# EAGLE design HshMain_v1.1 (EAGLE 7.4.0)
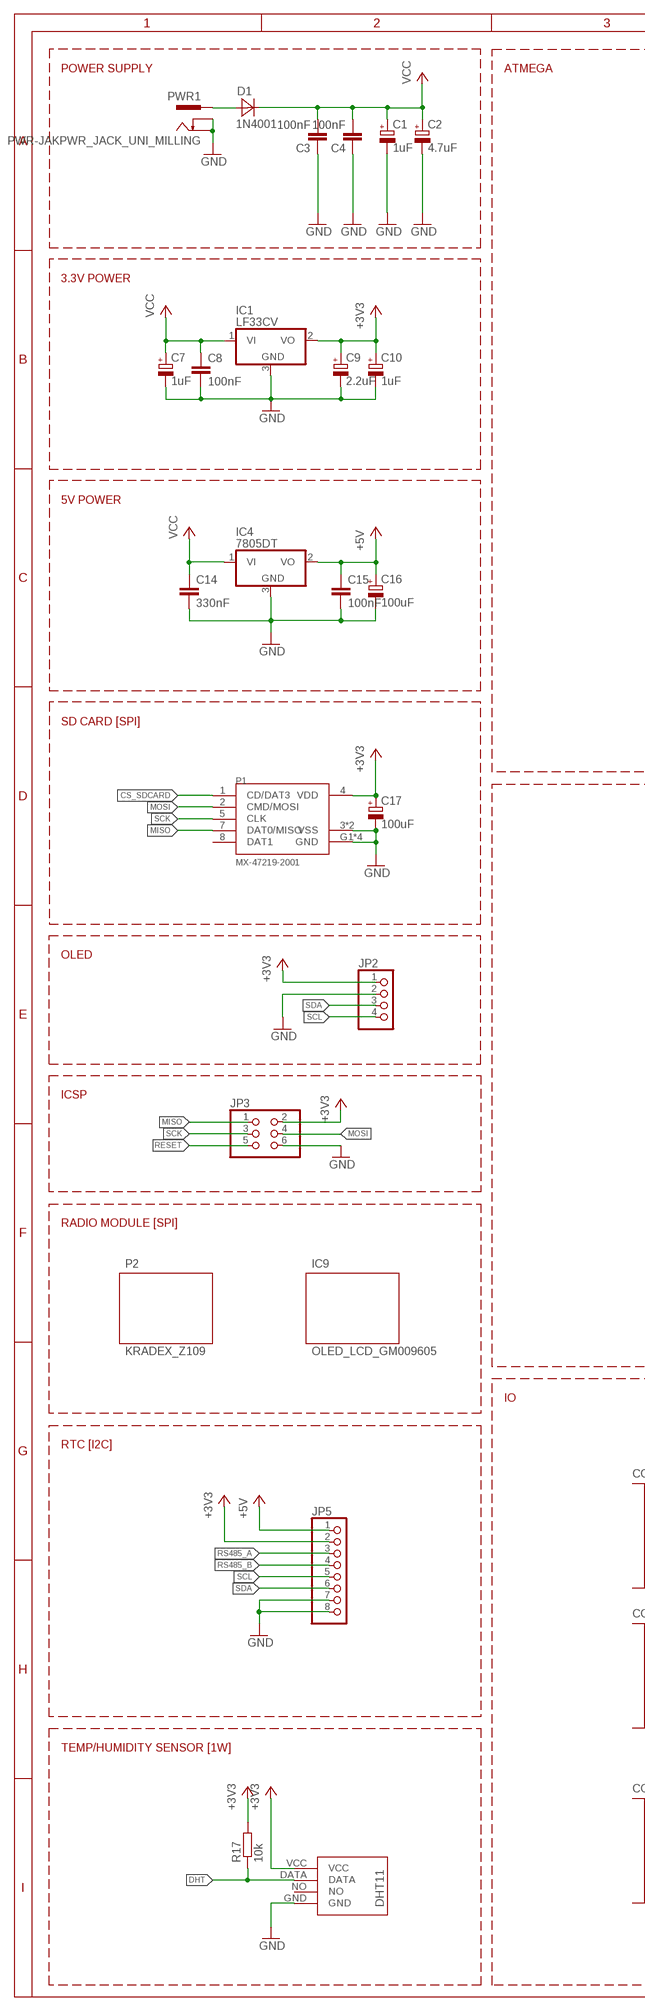
[diagram p0: schematic, sheet 1, part 1 of 2]
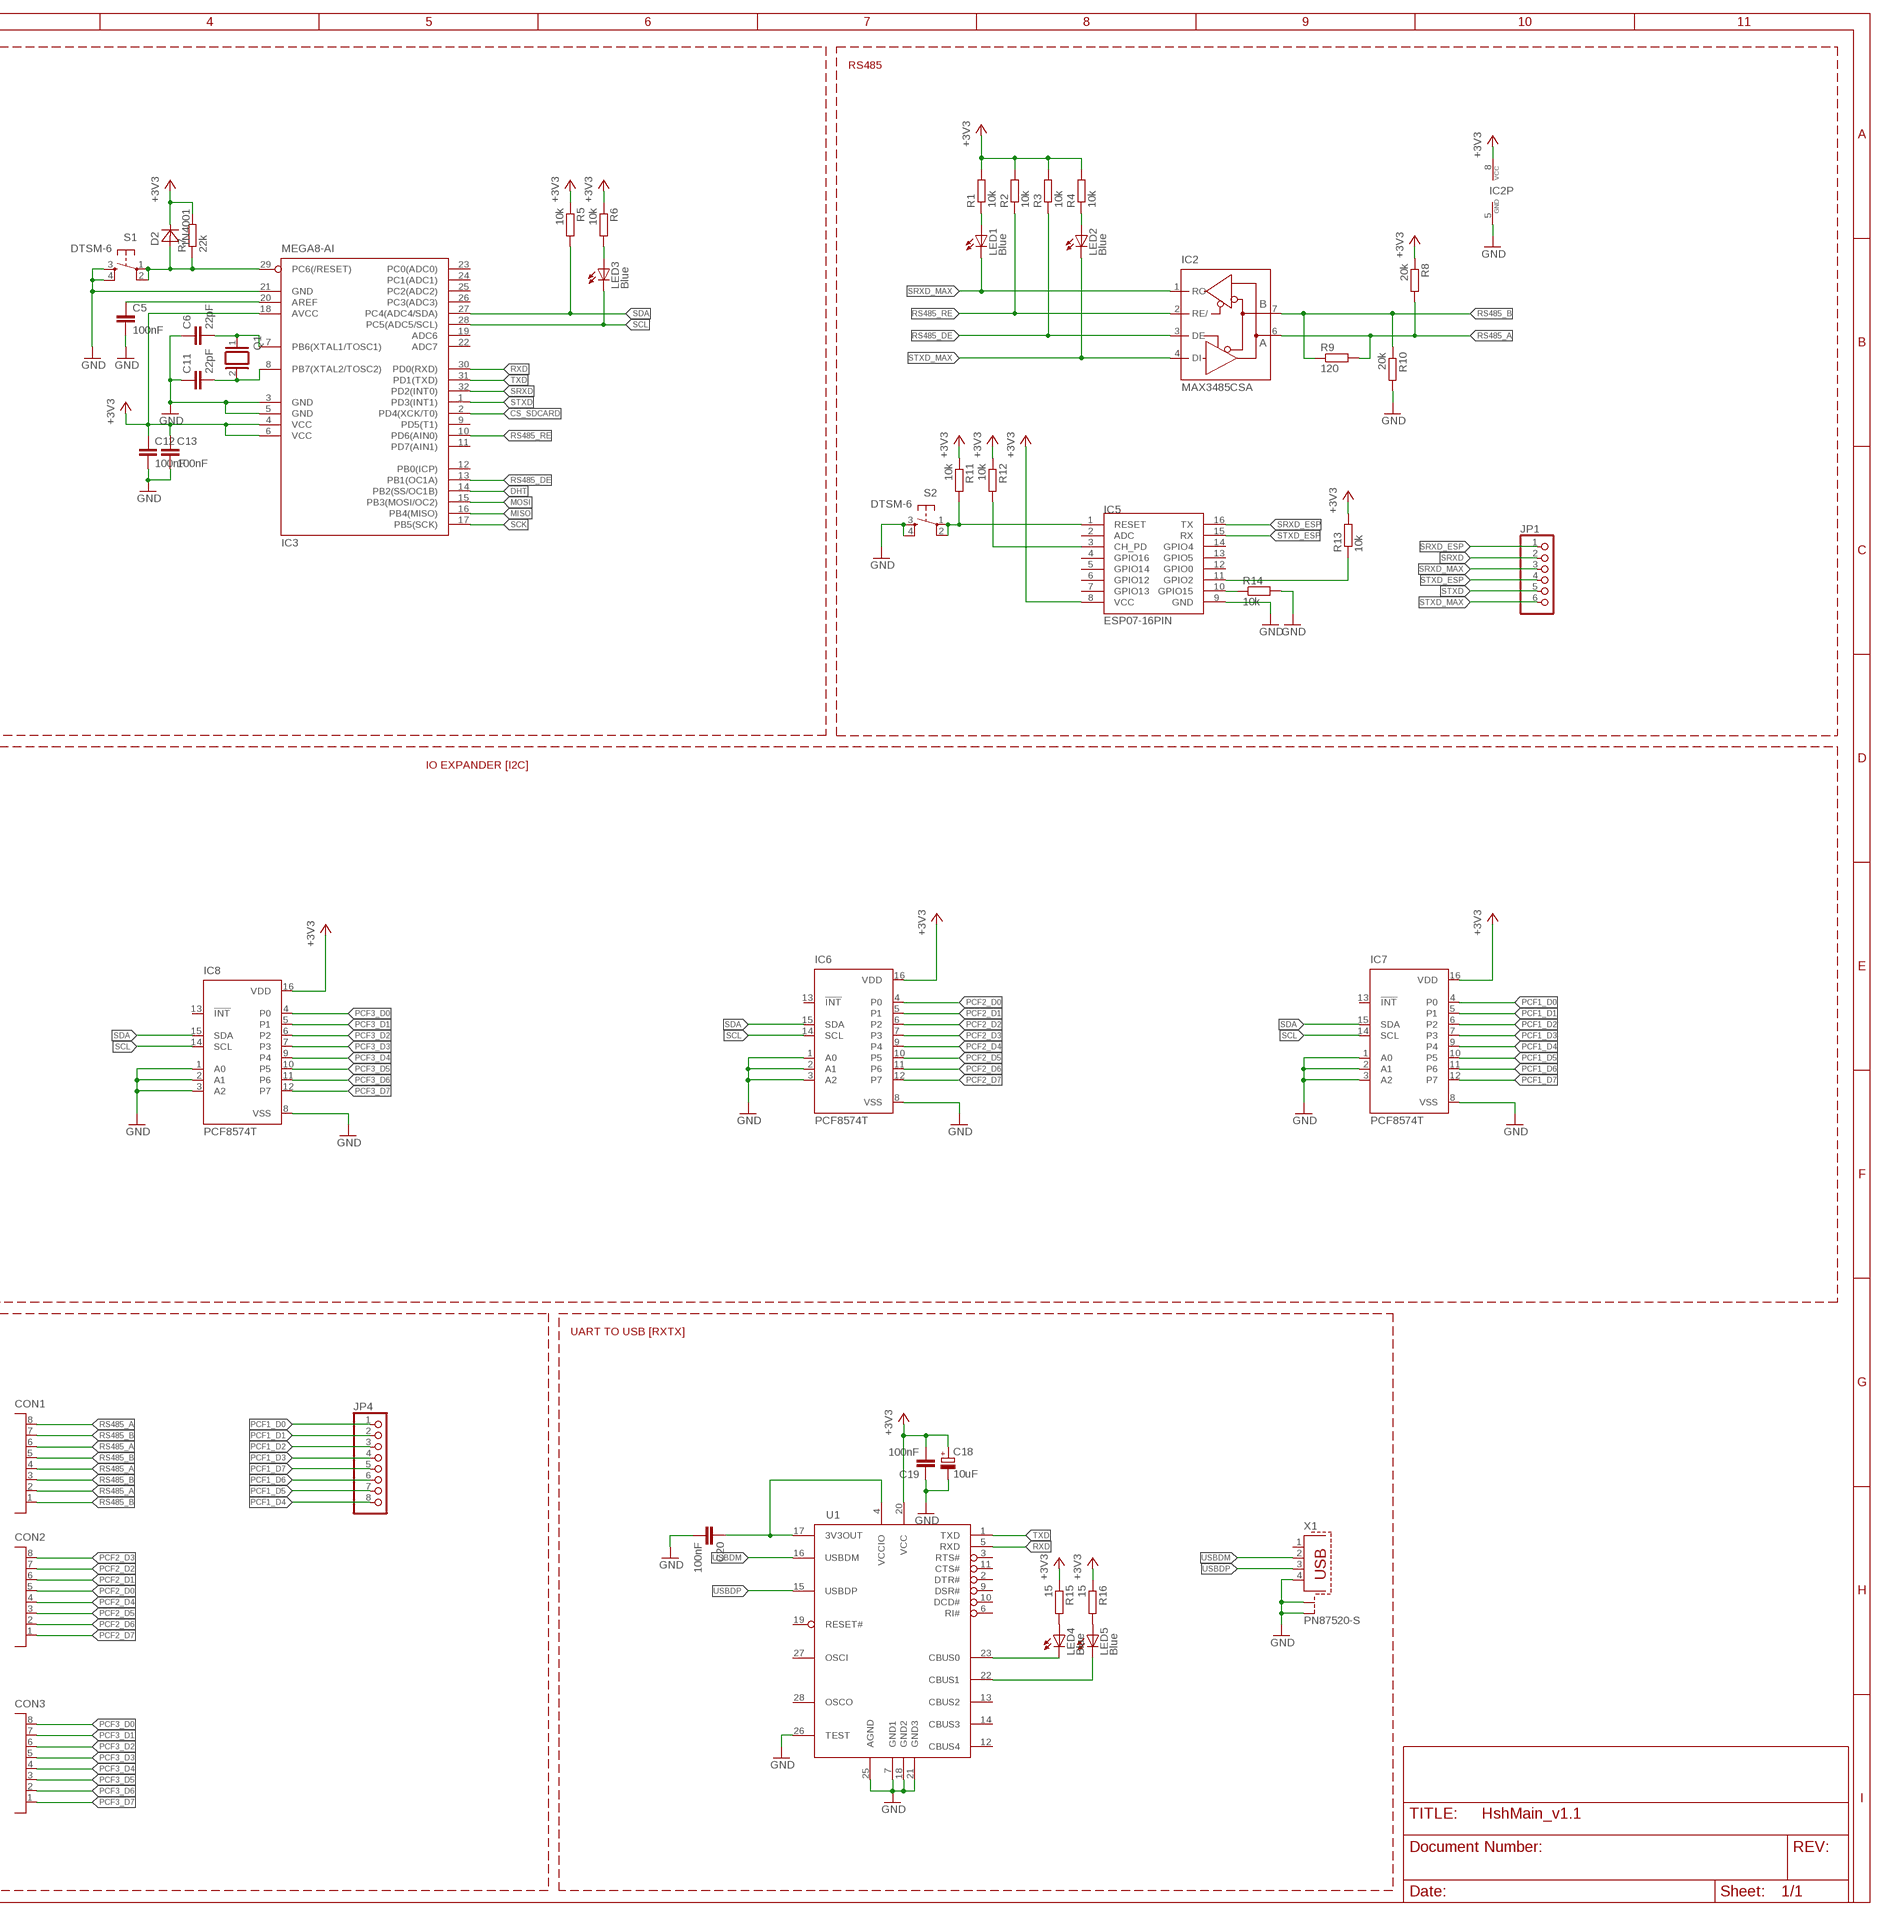
[diagram p1: schematic, sheet 1, part 2 of 2]

## Parts
C1  1uF  CPOL-EUB  [PANASONIC_B]
C2  4.7uF  CPOL-EUB  [PANASONIC_B]
C3  100nF  C-EUC0805  [C0805]
C4  100nF  C-EUC0805  [C0805]
C5  100nF  C-EUC0805  [C0805]
C6  22pF  C-EUC0805  [C0805]
C7  1uF  CPOL-EUB  [PANASONIC_B]
C8  100nF  C-EUC0805  [C0805]
C9  2.2uF  CPOL-EUB  [PANASONIC_B]
C10  1uF  CPOL-EUB  [PANASONIC_B]
C11  22pF  C-EUC0805  [C0805]
C12  100nF  C-EUC0805  [C0805]
C13  100nF  C-EUC0805  [C0805]
C14  330nF  C-EUC0805  [C0805]
C15  100nF  C-EUC0805  [C0805]
C16  100uF  CPOL-EUD  [PANASONIC_D]
C17  100uF  CPOL-EUD  [PANASONIC_D]
C18  10uF  CPOL-EUB  [PANASONIC_B]
C19  100nF  C-EUC0805  [C0805]
C20  100nF  C-EUC0805  [C0805]
CON1  15EDGRC-3.81-8P  [15EDGRC-3.81-8P]
CON2  15EDGRC-3.81-8P  [15EDGRC-3.81-8P]
CON3  15EDGRC-3.81-8P  [15EDGRC-3.81-8P]
D1  1N4001  MBRA340T3  [SMA]
D2  1N4001  MBRA340T3  [SMA]
IC1  LF33CV  78DT  [TO252]
IC2  MAX3485CSA  MAX481CSA  [SO08]
IC3  MEGA8-AI  [TQFP32-08]
IC4  7805DT  [TO252]
IC5  ESP07-16PIN  [ESP07-16PIN]
IC6  PCF8574T  [SO16W]
IC7  PCF8574T  [SO16W]
IC8  PCF8574T  [SO16W]
IC9  OLED_LCD_GM009605  [OLED_LCD_GM009605]
IC10  DHT11-PION.  [DHT11-PION.]
JP1  PINHD-1X6  [1X06]
JP2  PINHD-1X4  [1X04]
JP3  PINHD-2X3  [2X03]
JP4  PINHD-1X8  [1X08]
JP5  PINHD-1X8/90  [1X08/90]
LED1  Blue  LEDSML0805  [SML0805]
LED2  Blue  LEDSML0805  [SML0805]
LED3  Blue  LEDSML0805  [SML0805]
LED4  Blue  LEDSML0805  [SML0805]
LED5  Blue  LEDSML0805  [SML0805]
P1  MX-47219-2001  [MX-47219-2001]
P2  KRADEX_Z109  [KRADEX_Z109]
PWR1  PWR-JAKPWR_JACK_UNI_MILLING  [PWR_JACK_UNI_MILLING]
Q1  XTAL/S  [QS]
R1  10k  R-EU_R0805  [R0805]
R2  10k  R-EU_R0805  [R0805]
R3  10k  R-EU_R0805  [R0805]
R4  10k  R-EU_R0805  [R0805]
R5  10k  R-EU_R0805  [R0805]
R6  10k  R-EU_R0805  [R0805]
R7  22k  R-EU_R0805  [R0805]
R8  20k  R-EU_R0805  [R0805]
R9  120  R-EU_R0805  [R0805]
R10  20k  R-EU_R0805  [R0805]
R11  10k  R-EU_R0805  [R0805]
R12  10k  R-EU_R0805  [R0805]
R13  10k  R-EU_R0805  [R0805]
R14  10k  R-EU_R0805  [R0805]
R15  15  R-EU_R0805  [R0805]
R16  15  R-EU_R0805  [R0805]
R17  10k  R-EU_R0805  [R0805]
S1  DTSM-6  [DTSM-6]
S2  DTSM-6  [DTSM-6]
U1  FT232RL  [SSOP28DB]
X1  PN87520-S  [PN87520-S]

## Nets
+3V3: C9.+ C10.+ C12.1 C13.1 C17.+ C18.+ C19.2 D2.C IC1.2(VO) IC2.8(VCC) IC3.4(VCC) IC3.6(VCC) IC3.18(AVCC) IC5.8(VCC) IC6.16(VDD) IC7.16(VDD) IC8.16(VDD) IC10.VCC JP2.1 JP3.2 JP5.2 P1.4(VDD) R1.2 R2.2 R3.2 R4.2 R5.1 R6.1 R7.2 R8.1 R11.1 R12.1 R13.2 R15.1 R16.1 R17.2 U1.20(VCC)
+5V: C15.1 C16.+ IC4.2(VO) JP5.1
CS_SDCARD: IC3.2(PD4(XCK/T0)) P1.1(CD/DAT3)
DHT: IC3.14(PB2(SS/OC1B)) IC10.DATA R17.1
GND: C1.- C2.- C3.1 C4.1 C5.2 C6.1 C7.- C8.2 C9.- C10.- C11.1 C12.2 C13.2 C14.2 C15.2 C16.- C17.- C18.- C19.1 C20.2 IC1.3(GND) IC2.5(GND) IC3.3(GND) IC3.5(GND) IC3.21(GND) IC4.3(GND) IC5.9(GND) IC6.1(A0) IC6.2(A1) IC6.3(A2) IC6.8(VSS) IC7.1(A0) IC7.2(A1) IC7.3(A2) IC7.8(VSS) IC8.1(A0) IC8.2(A1) IC8.3(A2) IC8.8(VSS) IC10.GND JP2.2 JP3.6 JP5.7 JP5.8 P1.3(VSS) P1.6(VSS) P1.G1(GND) P1.G2(GND) P1.G3(GND) P1.G4(GND) PWR1.- PWR1.-1(-) PWR1.-2(-) PWR1.-3(-) PWR1.-4(-) PWR1.-5(-) PWR1.-6(-) PWR1.-7(-) PWR1.-8(-) PWR1.-- PWR1.--1(--) PWR1.--2(--) PWR1.--3(--) PWR1.--4(--) PWR1.--5(--) PWR1.--6(--) PWR1.--7(--) PWR1.--8(--) R10.2 R14.2 S1.3 S1.4 S2.3 S2.4 U1.7(GND1) U1.18(GND2) U1.21(GND3) U1.25(AGND) U1.26(TEST) X1.4 X1.S1 X1.S2
MISO: IC3.16(PB4(MISO)) JP3.1 P1.7(DAT0/MISO)
MOSI: IC3.15(PB3(MOSI/OC2)) JP3.4 P1.2(CMD/MOSI)
N$1: C5.1 IC3.20(AREF)
N$2: LED1.A R1.1
N$3: LED2.A R4.1
N$4: D1.A PWR1.+ PWR1.+1(+) PWR1.+2(+) PWR1.+3(+) PWR1.+4(+) PWR1.+5(+) PWR1.+6(+) PWR1.+7(+) PWR1.+8(+)
N$5: LED3.A R6.2
N$7: IC5.10(GPIO15) R14.1
N$8: IC5.11(GPIO2) R13.1
N$9: IC5.1(RESET) R11.2 S2.1 S2.2
N$12: IC5.3(CH_PD) R12.2
N$27: LED4.C U1.23(CBUS0)
N$28: LED5.C U1.22(CBUS1)
N$29: C6.2 IC3.7(PB6(XTAL1/TOSC1)) Q1.1
N$32: LED4.A R15.2
N$33: LED5.A R16.2
N$35: C11.2 IC3.8(PB7(XTAL2/TOSC2)) Q1.2
N$96: C20.1 U1.4(VCCIO) U1.17(3V3OUT)
PCF1_D0: IC7.4(P0) JP4.1
PCF1_D1: IC7.5(P1) JP4.2
PCF1_D2: IC7.6(P2) JP4.3
PCF1_D3: IC7.7(P3) JP4.4
PCF1_D4: IC7.9(P4) JP4.8
PCF1_D5: IC7.10(P5) JP4.7
PCF1_D6: IC7.11(P6) JP4.6
PCF1_D7: IC7.12(P7) JP4.5
PCF2_D0: CON2.5 IC6.4(P0)
PCF2_D1: CON2.6 IC6.5(P1)
PCF2_D2: CON2.7 IC6.6(P2)
PCF2_D3: CON2.8 IC6.7(P3)
PCF2_D4: CON2.4 IC6.9(P4)
PCF2_D5: CON2.3 IC6.10(P5)
PCF2_D6: CON2.2 IC6.11(P6)
PCF2_D7: CON2.1 IC6.12(P7)
PCF3_D0: CON3.8 IC8.4(P0)
PCF3_D1: CON3.7 IC8.5(P1)
PCF3_D2: CON3.6 IC8.6(P2)
PCF3_D3: CON3.5 IC8.7(P3)
PCF3_D4: CON3.4 IC8.9(P4)
PCF3_D5: CON3.3 IC8.10(P5)
PCF3_D6: CON3.2 IC8.11(P6)
PCF3_D7: CON3.1 IC8.12(P7)
RESET: D2.A IC3.29(PC6(/RESET)) JP3.5 R7.1 S1.1 S1.2
RS485_A: CON1.2 CON1.4 CON1.6 CON1.8 IC2.6(A) JP5.3 R8.2 R9.2
RS485_B: CON1.1 CON1.3 CON1.5 CON1.7 IC2.7(B) JP5.4 R9.1 R10.1
RS485_DE: IC2.3(DE) IC3.13(PB1(OC1A)) R3.1
RS485_RE: IC2.2(RE/) IC3.10(PD6(AIN0)) R2.1
RXD: IC3.30(PD0(RXD)) U1.5(RXD)
SCK: IC3.17(PB5(SCK)) JP3.3 P1.5(CLK)
SCL: IC3.28(PC5(ADC5/SCL)) IC6.14(SCL) IC7.14(SCL) IC8.14(SCL) JP2.4 JP5.5 LED3.C
SDA: IC3.27(PC4(ADC4/SDA)) IC6.15(SDA) IC7.15(SDA) IC8.15(SDA) JP2.3 JP5.6 R5.2
SRXD: IC3.32(PD2(INT0)) JP1.2
SRXD_ESP: IC5.16(TX) JP1.1
SRXD_MAX: IC2.1(RO) JP1.3 LED1.C
STXD: IC3.1(PD3(INT1)) JP1.5
STXD_ESP: IC5.15(RX) JP1.4
STXD_MAX: IC2.4(DI) JP1.6 LED2.C
TXD: IC3.31(PD1(TXD)) U1.1(TXD)
USBDM: U1.16(USBDM) X1.2
USBDP: U1.15(USBDP) X1.3
VCC: C1.+ C2.+ C3.2 C4.2 C7.+ C8.1 C14.1 D1.C IC1.1(VI) IC4.1(VI)
Unconnected: IC3.9(PD5(T1)) IC3.11(PD7(AIN1)) IC3.12(PB0(ICP)) IC3.19(ADC6) IC3.22(ADC7) IC3.23(PC0(ADC0)) IC3.24(PC1(ADC1)) IC3.25(PC2(ADC2)) IC3.26(PC3(ADC3)) IC5.2(ADC) IC5.4(GPIO16) IC5.5(GPIO14) IC5.6(GPIO12) IC5.7(GPIO13) IC5.12(GPIO0) IC5.13(GPIO5) IC5.14(GPIO4) IC6.13(!INT) IC7.13(!INT) IC8.13(!INT) IC10.NO P1.8(DAT1) U1.2(DTR#) U1.3(RTS#) U1.6(RI#) U1.9(DSR#) U1.10(DCD#) U1.11(CTS#) U1.12(CBUS4) U1.13(CBUS2) U1.14(CBUS3) U1.19(RESET#) U1.27(OSCI) U1.28(OSCO) X1.1

## Notes on the sheet
- POWER SUPPLY | ATMEGA | RS485
- 3.3V POWER
- 5V POWER
- SD CARD [SPI]
- IO EXPANDER [I2C]
- OLED
- ICSP
- RADIO MODULE [SPI]
- IO | UART TO USB [RXTX]
- RTC [I2C]
- TEMP/HUMIDITY SENSOR [1W]

## Library data of the parts
C1 C2 C7 C9 C10 C16-C18 = rcl:CPOL-EU: POLARIZED CAPACITOR, European symbol
C3-C6 C8 C11-C15 C19 C20 = rcl:C-EU: CAPACITOR, European symbol
CON1-CON3 = con-degson:15EDGRC-3.81-8P
D1 D2 = diode:MBRA340T3: Surface Mount Schottky Power Rectifier Source: http://www.onsemi.com/pub_link/Collateral/MBRA340T3-D.PDF
IC1 = hosho:78*: Positive VOLTAGE REGULATOR Source: http://cache.national.com/ds/LM/LM78L05.pdf http://www.fairchildsemi.com/ds/LM/LM7805.pdf
IC2 = maxim:MAX481CSA: RS485 TRANSEIVER; MF: MAXIM; MPN: MAX481CSA; OC_FARNELL: unknown; OC_NEWARK: 90C3817
IC3 = atmel:MEGA8: MICROCONTROLLER 8 Kbytes FLASH, 1 kbytes SRAM, 512 bytes EEPROM, USART, 6-channel 10 bit ADC, 2-channel 8 bit ADC Pin compatible with Atmega48, ATMega88, ATMega168 Source: avr.lbr; MPN: ATMEGA8-16AU; OC_FARNELL: 9171371; OC_NEWARK: 73M8863
IC4 = linear:78*: Positive VOLTAGE REGULATOR Source: http://cache.national.com/ds/LM/LM78L05.pdf http://www.fairchildsemi.com/ds/LM/LM7805.pdf
IC5 = esp8266modules:ESP07-16PIN: ESP8266 Wifi module 07 - 16 pins; DIMENSIONS: 22.0 x 16.0 mm; PINS: 16; PITCH: 0.078" / 2 mm
IC6-IC8 = micro-philips:PCF8574: I2C-Bus Remote 8-bit I/O expander http://www.semiconductors.philips.com/acrobat_download/datasheets/PCF8574_4.pdf; MPN: PCF8574T/3,512; OC_FARNELL: 1201255; OC_NEWARK: 70R6870
IC9 = hosho:OLED_LCD_GM009605
IC10 = hosho:DHT11-PION.: DHT11 Czujnik temperatury i wilgotności (widok pionowy)
JP1 = pinhead:PINHD-1X6: PIN HEADER
JP2 = pinhead:PINHD-1X4: PIN HEADER
JP3 = pinhead:PINHD-2X3: PIN HEADER
JP4 JP5 = pinhead:PINHD-1X8: PIN HEADER
LED1-LED5 = led:LED: LED OSRAM: - CHIPLED LG R971, LG N971, LY N971, LG Q971, LY Q971, LO R971, LY R971 LH N974, LH R974 LS Q976, LO Q976, LY Q976 LO Q996 - Hyper CHIPLED LW Q18S LB Q993, LB Q99A, LB R99A - SideLED LS A670, LO A670, LY A670, LG A670, LP A670 LB A673, LV A673, LT A673, LW A673 LH A674 LY A675 LS A676, LA A676, LO A676, LY A676, LW A676 LS A679, LY A679, LG A679 - Hyper Micro SIDELED® LS Y876, LA Y876, LO Y876, LY Y876 LT Y87S - SmartLED LW L88C, LW L88S LB L89C, LB L89S, LG L890 LS L89K, LO L89K, LY L89K LS L896, LA L896, LO L896, LY L896 - TOPLED LS T670, LO T670, LY T670, LG T670, LP T670 LSG T670, LSP T670, LSY T670, LOP T670, LYG T670 LG T671, LOG T671, LSG T671 LB T673, LV T673, LT T673, LW T673 LH T674 LS T676, LA T676, LO T676, LY T676, LB T676, LH T676, LSB T676, LW T676 LB T67C, LV T67C, LT T67C, LS T67K, LO T67K, LY T67K, LW E67C LS E67B, LA E67B, LO E67B, LY E67B, LB E67C, LV E67C, LT E67C LW T67C LS T679, LY T679, LG T679 LS T770, LO T770, LY T770, LG T770, LP T770 LB T773, LV T773, LT T773, LW T773 LH T774 LS E675, LA E675, LY E675, LS T675 LS T776, LA T776, LO T776, LY T776, LB T776 LHGB T686 LT T68C, LB T68C - Hyper Mini TOPLED® LB M676 - Mini TOPLED Santana® LG M470 LS M47K, LO M47K, LY M47K Source: http://www.osram.convergy.de LUXEON: - LUMILED® LXK2-PW12-R00, LXK2-PW12-S00, LXK2-PW14-U00, LXK2-PW14-V00 LXK2-PM12-R00, LXK2-PM12-S00, LXK2-PM14-U00 LXK2-PE12-Q00, LXK2-PE12-R00, LXK2-PE12-S00, LXK2-PE14-T00, LXK2-PE14-U00 LXK2-PB12-K00, LXK2-PB12-L00, LXK2-PB12-M00, LXK2-PB14-N00, LXK2-PB14-P00, LXK2-PB14-Q00 LXK2-PR12-L00, LXK2-PR12-M00, LXK2-PR14-Q00, LXK2-PR14-R00 LXK2-PD12-Q00, LXK2-PD12-R00, LXK2-PD12-S00 LXK2-PH12-R00, LXK2-PH12-S00 LXK2-PL12-P00, LXK2-PL12-Q00, LXK2-PL12-R00 Source: www.luxeon.com KINGBRIGHT: KA-3528ASYC Source: www.kingbright.com
P1 = hosho:MX-47219-2001
P2 = hosho:KRADEX_Z109
PWR1 = hosho:PWR-JAK
Q1 = special:XTAL/S: CRYSTAL
R1-R17 = rcl:R-EU_: RESISTOR, European symbol
S1 S2 = hosho:DTSM-6
U1 = ftdichip-5:FT232RL: USB UART 4th Generation USB UART (USB <-> Serial) Controller
X1 = hosho:PN87520-S; OC_FARNELL: unknown; OC_NEWARK: unknown

## Board
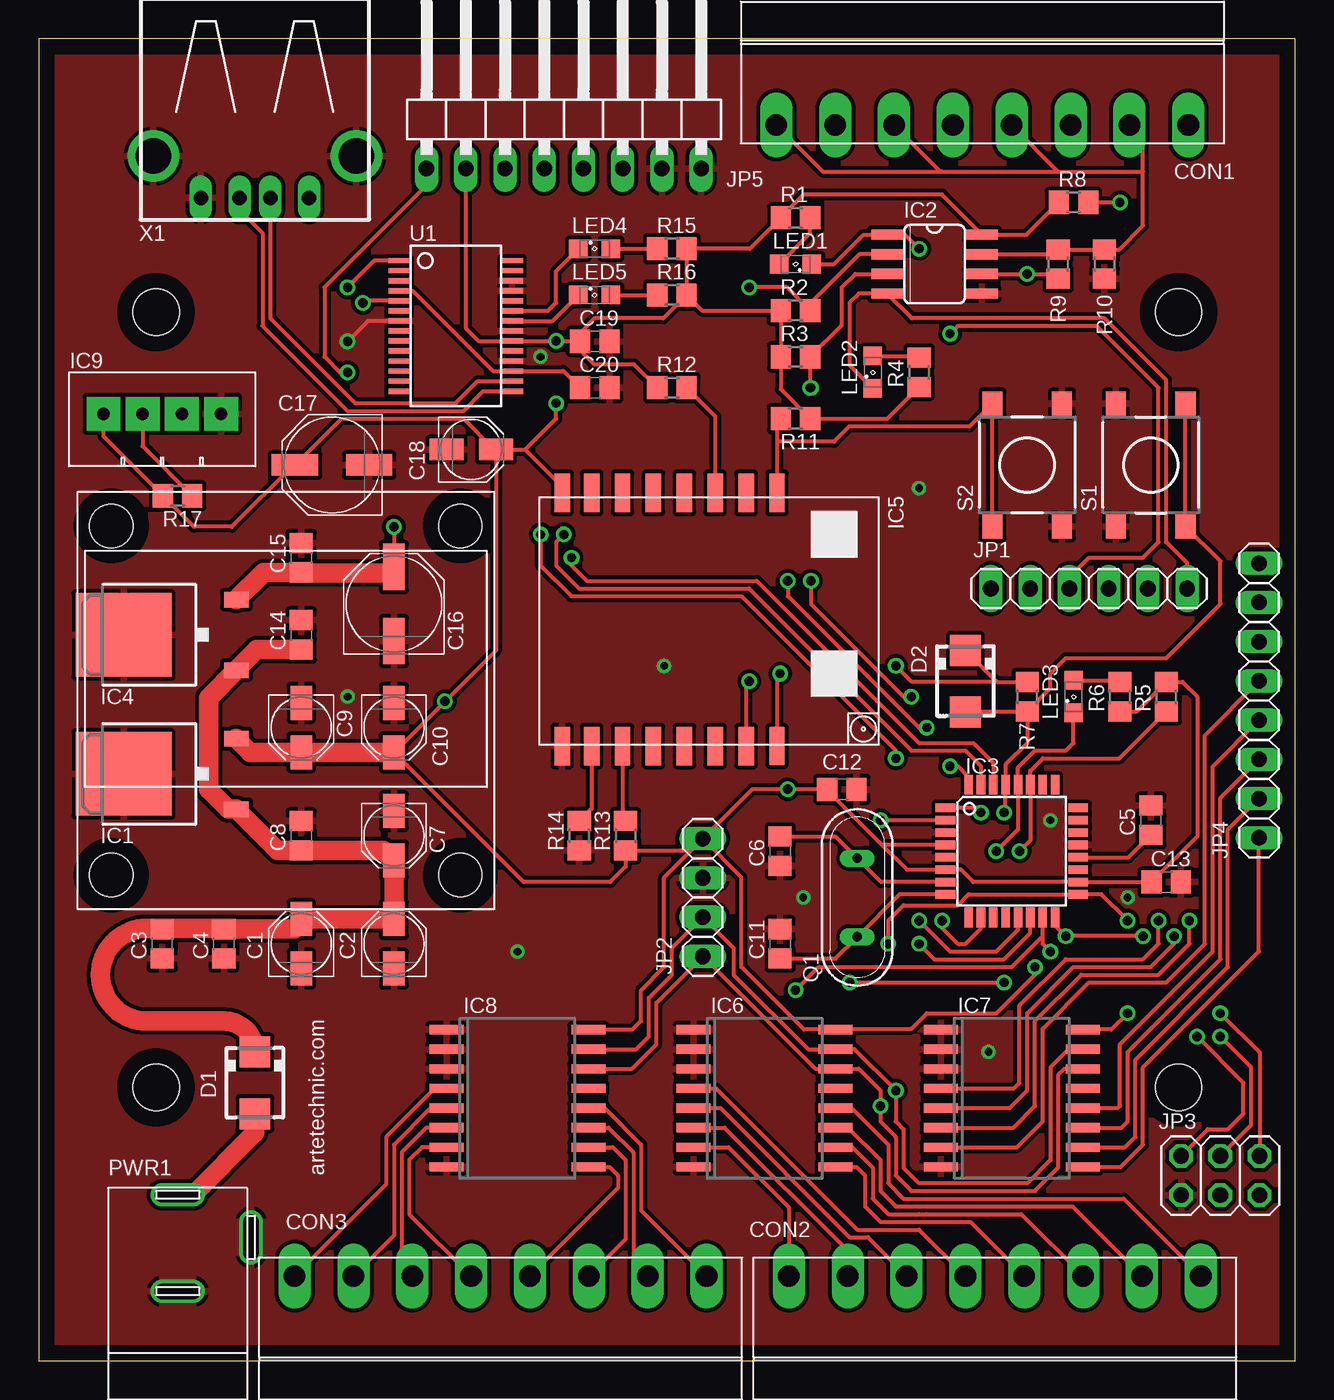
[diagram p2: board, top side]
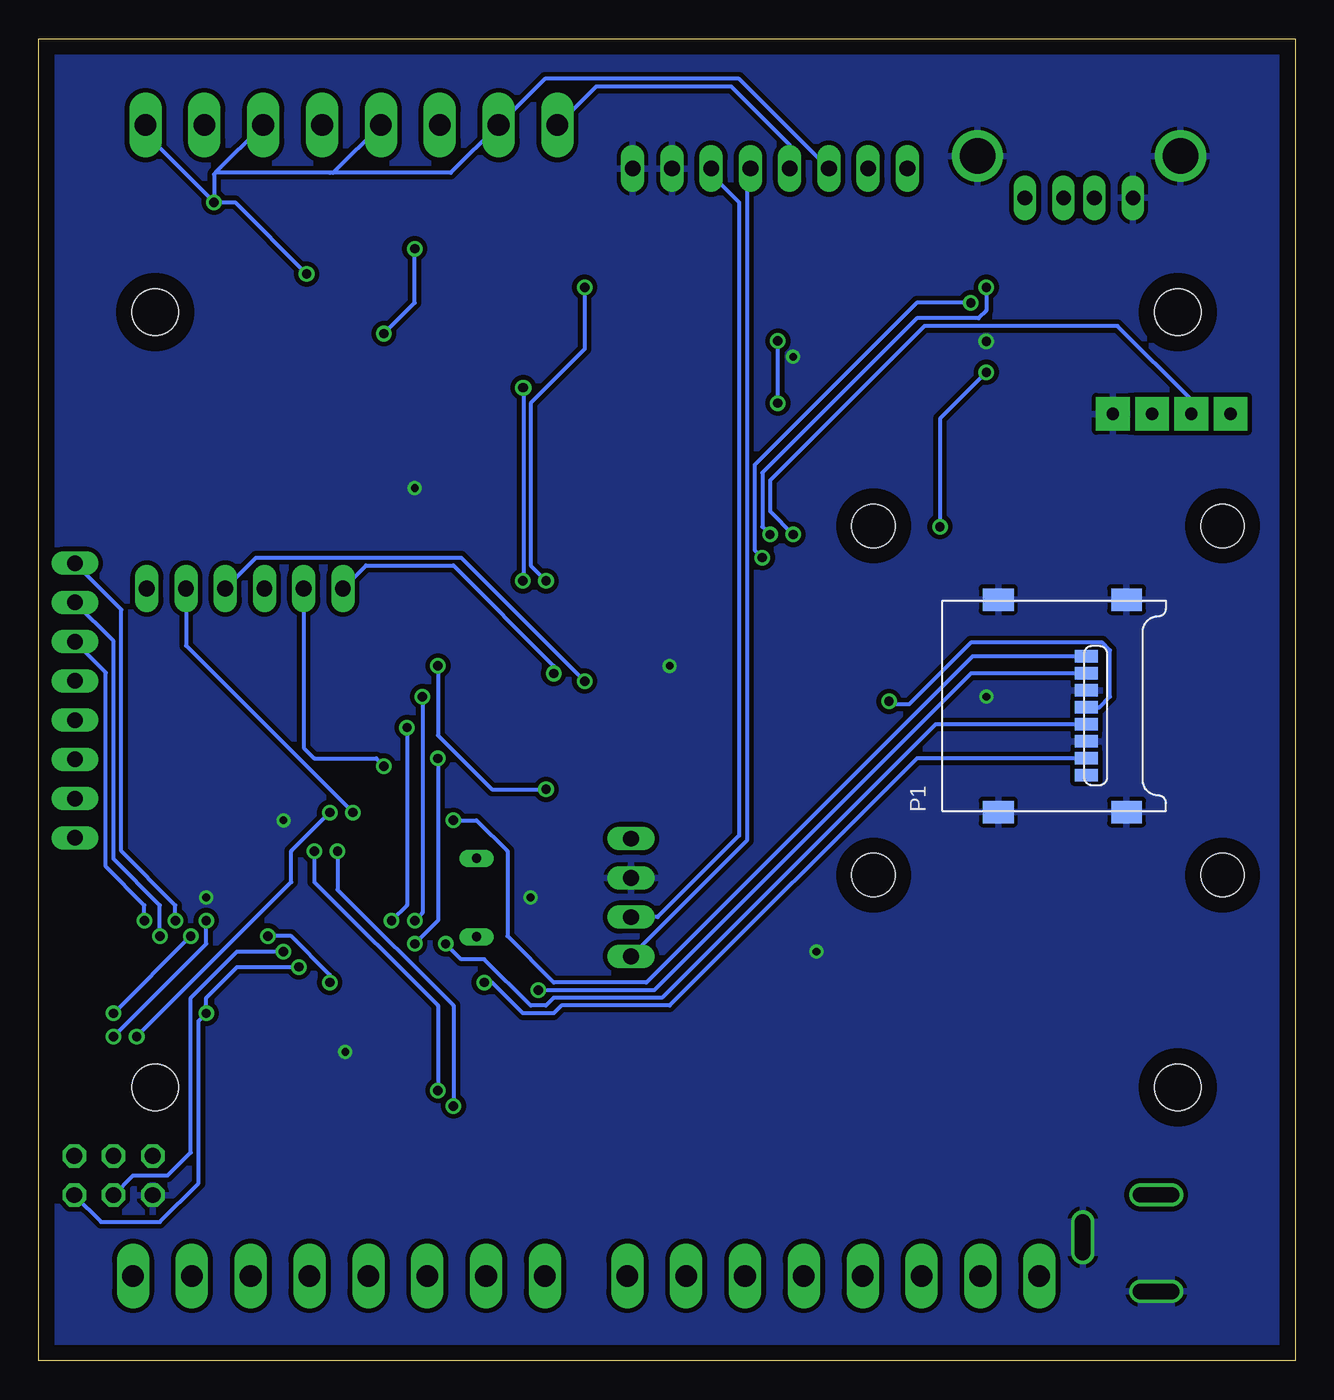
[diagram p3: board, bottom side, seen from below]

Size 81.35 x 85.6 mm. Coordinates in mm from the lower left corner, seen from the top.
Outline: 0,0 81.35,0 81.35,85.6 0,85.6 0,0
Copper layers (1*16): Top 0.035mm / dielectric 1.5mm / Bottom 0.035mm
Design rules "default": minimum track width 10mil, minimum drill 24mil, track to track 8mil, track to pad 8mil, pad to pad 8mil, via to via 8mil, smd to smd 8mil, copper to edge 40mil, drill to drill 8mil, minimum pad ring 10mil, minimum via ring 8mil, stop-mask expansion 4mil, vias tented up to drill 0mil, thermal gap 10mil
Holes 3 mm at 7.6,17.7 73.8,17.7 7.6,67.9 73.8,67.9

### Footprints (pad centres in the part's own frame; a part is rotated, then mirrored left to right if it is on the bottom)
PANASONIC_B = smd 2.2 x 1.4: + 1.6,0; - -1.6,0
C0805 = smd 1.3 x 1.5: 1 -0.95,0; 2 0.95,0
PANASONIC_D = smd 3 x 1.4: + 2.4,0; - -2.4,0
15EDGRC-3.81-8P = drill 1.4 long: 1 -15.24,0; 2 -11.43,0; 3 -7.62,0; 4 -3.81,0; 5 0,0; 6 3.81,0; 7 7.62,0; 8 11.43,0
SMA = smd 2 x 2: A 2,0; C -2,0
TO252 = smd 1 x 1.6: 1 -2.28,-4.8; 2 2.28,-4.8 | smd 5.4 x 6.2: 3 0,2.5
SO08 = smd 0.66 x 2.032: 1 -1.905,-3.073; 2 -0.635,-3.073; 3 0.635,-3.073; 4 1.905,-3.073; 5 1.905,3.073; 6 0.635,3.073; 7 -0.635,3.073; 8 -1.905,3.073
TQFP32-08 = smd 1.27 x 0.559: 1 -4.293,2.8; 2 -4.293,2; 3 -4.293,1.2; 4 -4.293,0.4; 5 -4.293,-0.4; 6 -4.293,-1.2; 7 -4.293,-2; 8 -4.293,-2.8; 17 4.293,-2.8; 18 4.293,-2; 19 4.293,-1.2; 20 4.293,-0.4; 21 4.293,0.4; 22 4.293,1.2; 23 4.293,2; 24 4.293,2.8 | smd 0.559 x 1.27: 9 -2.8,-4.293; 10 -2,-4.293; 11 -1.2,-4.293; 12 -0.4,-4.293; 13 0.4,-4.293; 14 1.2,-4.293; 15 2,-4.293; 16 2.8,-4.293; 25 2.8,4.293; 26 2,4.293; 27 1.2,4.293; 28 0.4,4.293; 29 -0.4,4.293; 30 -1.2,4.293; 31 -2,4.293; 32 -2.8,4.293
ESP07-16PIN = smd 2.5 x 1: 1 -8.2,5.8; 2 -8.2,3.8; 3 -8.2,1.8; 4 -8.2,-0.2; 5 -8.2,-2.2; 6 -8.2,-4.2; 7 -8.2,-6.2; 8 -8.2,-8.105; 9 8.2,-8.105; 10 8.2,-6.2; 11 8.2,-4.2; 12 8.2,-2.2; 13 8.2,-0.2; 14 8.2,1.8; 15 8.2,3.8; 16 8.2,5.8
SO16W = smd 0.6 x 2.2: 1 -4.445,-4.6; 2 -3.175,-4.6; 3 -1.905,-4.6; 4 -0.635,-4.6; 5 0.635,-4.6; 6 1.905,-4.6; 7 3.175,-4.6; 8 4.445,-4.6; 9 4.445,4.6; 10 3.175,4.6; 11 1.905,4.6; 12 0.635,4.6; 13 -0.635,4.6; 14 -1.905,4.6; 15 -3.175,4.6; 16 -4.445,4.6
OLED_LCD_GM009605 = hole 2.8: -11.3,-11.3; -11.3,11.3; 11.3,11.3; 11.3,-11.3
DHT11-PION. = drill 0.8 pad 2.184 square: DATA -1.27,0.305; GND 3.81,0.305; NO 1.27,0.305; VCC -3.81,0.305
1X06 = drill 1.016 long: 1 -6.35,0; 2 -3.81,0; 3 -1.27,0; 4 1.27,0; 5 3.81,0; 6 6.35,0
1X04 = drill 1.016 long: 1 -3.81,0; 2 -1.27,0; 3 1.27,0; 4 3.81,0
2X03 = drill 1.016 octagon: 1 -2.54,-1.27; 2 -2.54,1.27; 3 0,-1.27; 4 0,1.27; 5 2.54,-1.27; 6 2.54,1.27
1X08 = drill 1.016 long: 1 -8.89,0; 2 -6.35,0; 3 -3.81,0; 4 -1.27,0; 5 1.27,0; 6 3.81,0; 7 6.35,0; 8 8.89,0
1X08/90 = drill 1.016 long: 1 -8.89,-3.81; 2 -6.35,-3.81; 3 -3.81,-3.81; 4 -1.27,-3.81; 5 1.27,-3.81; 6 3.81,-3.81; 7 6.35,-3.81; 8 8.89,-3.81
SML0805 = smd 1.2 x 1.2: A 1.05,0; C -1.05,0
MX-47219-2001 = smd 0.8 x 1.5: 1 10.08,2.6; 2 8.98,2.6; 3 7.88,2.6; 4 6.78,2.6; 5 5.68,2.6; 6 4.58,2.6; 7 3.48,2.6; 8 2.38,2.6 | smd 1.45 x 2: G1 13.75,0; G2 13.75,8.3; G3 0,8.3; G4 0,0
PWR_JACK_UNI_MILLING = drill 1: + -6.25,0; +1 -6.25,0.25; +2 -6.25,0.5; +3 -6.25,0.75; +4 -6.25,1; +5 -6.25,-0.25; +6 -6.25,-0.5; +7 -6.25,-0.75; +8 -6.25,-1; - 0,0; -1 0,0.25; -2 0,0.5; -3 0,0.75; -4 0,1; -5 0,-0.25; -6 0,-0.5; -7 0,-0.75; -8 0,-1; -- -3.5,4.75; --1 -3.75,4.75; --2 -4,4.75; --3 -4.25,4.75; --4 -4.5,4.75; --5 -3.25,4.75; --6 -3,4.75; --7 -2.75,4.75; --8 -2.5,4.75
QS = drill 0.61 long: 1 -2.54,0; 2 2.54,0
R0805 = smd 1.3 x 1.5: 1 -0.95,0; 2 0.95,0
DTSM-6 = smd 1.55 x 1.3: 1 -3.975,2.25; 2 3.975,2.25; 3 -3.975,-2.25; 4 3.975,-2.25
SSOP28DB = smd 0.348 x 1.397: 1 -4.225,-3.656; 2 -3.575,-3.656; 3 -2.925,-3.656; 4 -2.275,-3.656; 5 -1.625,-3.656; 6 -0.975,-3.656; 7 -0.325,-3.656; 8 0.325,-3.656; 9 0.975,-3.656; 10 1.625,-3.656; 11 2.275,-3.656; 12 2.925,-3.656; 13 3.575,-3.656; 14 4.225,-3.656; 15 4.225,3.656; 16 3.575,3.656; 17 2.925,3.656; 18 2.275,3.656; 19 1.625,3.656; 20 0.975,3.656; 21 0.325,3.656; 22 -0.325,3.656; 23 -0.975,3.656; 24 -1.625,3.656; 25 -2.275,3.656; 26 -2.925,3.656; 27 -3.575,3.656; 28 -4.225,3.656
PN87520-S = drill 0.95 long: 1 -3.5,2.71; 2 -1,2.71; 3 1,2.71; 4 3.5,2.71 | drill 2.3 pad 2.9: S1 -6.57,0; S2 6.57,0

### Placement (x,y rotation side)
C1  17,27 90 top
C2  23,27 90 top
C3  8,27 90 top
C4  12,27 90 top
C5  72,35 90 top
C6  48,33 90 top
C7  23,34 270 top
C8  17,34 90 top
C9  17,41 270 top
C10  23,41 270 top
C11  48,27 270 top
C12  52,37 0 top
C13  73,31 0 top
C14  17,47 90 top
C15  17,52 90 top
C16  23,49 90 top
C17  19,58 180 top
C18  28,59 0 top
C19  36,66 180 top
C20  36,63 0 top
CON1  63,80 0 top
CON2  60,5.5 180 top
CON3  28,5.5 180 top
D1  14,18 270 top
D2  60,44 270 top
IC1  8,38 90 top
IC2  58,71 270 top
IC3  63,33 0 top
IC4  8,47 90 top
IC5  42,48 270 top
IC6  47,17 270 top
IC7  63,17 270 top
IC8  31,17 270 top
IC9  16,42.75 0 top
IC10  8,61 0 top
JP1  68,50 0 top
JP2  43,30 270 top
JP3  76.5,12 180 top
JP4  79,42.75 270 top
JP5  34,81 0 top
LED1  49,71 180 top
LED2  54,64 90 top
LED3  67,43 90 top
LED4  36,72 0 top
LED5  36,69 0 top
P1  10.92,35.53 90 bottom
P2  -3.05,-2.2 0 top  (outside the outline)
PWR1  9,4.5 270 top
Q1  53,30 270 top
R1  49,74 180 top
R2  49,68 180 top
R3  49,65 180 top
R4  57,64 270 top
R5  73,43 270 top
R6  70,43 90 top
R7  64,43 90 top
R8  67,75 0 top
R9  66,71 270 top
R10  69,71 270 top
R11  49,61 180 top
R12  41,63 0 top
R13  38,34 270 top
R14  35,34 270 top
R15  41,72 180 top
R16  41,69 180 top
R17  9,56 180 top
S1  72,58 270 top
S2  64,58 90 top
U1  27,67 270 top
X1  14,78 180 top

### Tracks (layer width: path | path; a pad name or v marks a point on that pad's centre or on a via)
+3V3  (via drill 0.6)
  Top 0.254: 54.6,33.4 56.2,31.8 IC3.6 59.7,31.8 60.5,31 IC3.18 C13.1 75,33.95 75,43 74.05,43.95 R5.1 71.1,42.05 R6.1 | IC3.4 54.6,33.4 | C19.2 35.02,66.03 v33.5,66.03 U1.20 28.48,66.03 27.65,66.85 JP5.2 | R12.1 38.55,64.5 36,64.5 35,65.5 35,65.95 C19.2 | R16.1 R15.1 46.05,72 R1.2 48.05,74.05 49.5,75.5 58.48,75.5 IC2.8 63.95,72.91 R8.1 | R4.2 54.95,61 R11.1 48.05,62.9 R3.2 R2.2 42.95,68 R16.1 | v70.5,22.5 69.44,21.45 IC7.16 | IC8.16 38.45,21.45 39,22 39,24 40.5,25.5 40.5,31.31 JP2.1 | JP2.1 42.24,33.05 R13.2 38,32 37,31 31.4,31 C10.+ v26.3,42.7 29.6,46 C18.+ | R16.1 40.45,67.5 36,67.5 35.05,66.55 C19.2 | JP2.1 45.5,31.31 45.5,25.5 49.55,21.45 IC6.16 51.66,21.5 56.5,21.5 57.5,22.5 62,22.5 64.5,25 v64.5,25.5 | C18.+ 31.5,59 | 31.5,59 33.5,61 v33.5,62 | D2.C 62.05,43.95 | 62.05,43.95 R7.2 | C18.+ 29.5,59 27.5,61 19.6,61 C17.+ 16.5,58 12.5,54 10.05,54 R17.2 4.19,59.86 IC10.VCC | IC5.8 33.9,56.6 31.5,59 | JP2.1 46.19,37 v48.5,37 C12.1 51.05,36.95 54.6,33.4 | 62.05,43.95 56.55,43.95 v55.5,45
  Top 1.27: C10.+ C9.+ 13.68,39.4 IC1.2
  Bottom 0.254: JP3.2 77.31,9 73.5,9 71,11.5 71,22 v70.5,22.5 70.5,23.5 68.5,25.5 v64.5,25.5 | v33.5,62 v33.5,66.03 | v55.5,45 55.5,40.5 52,37 v48.5,37 | P1.4 12.69,42.31 12,43 12,46 12.5,46.5 21,46.5 25,42.5 26.1,42.5 v26.3,42.7
+5V  (via drill 0.6)
  Top 0.254: JP5.1 25.11,76.11 18.5,69.5 18.5,65 19.5,64 v20,64 | v23,54 C16.+
  Top 1.27: IC4.2 14.57,51.05 C15.1 17.05,51 23,51 C16.+
  Bottom 0.254: v20,64 23,61 v23,54
CS_SDCARD  (via drill 0.6)
  Top 0.254: IC3.2 v54.5,35
  Bottom 0.254: P1.1 20.89,45.61 42,24.5 48,24.5 51,27.5 51,33 53,35 v54.5,35
DHT  (via drill 0.6)
  Top 0.254: IC10.DATA 6.73,59.22 R17.1 | v32.5,53.5 32.5,51.5 34.5,49.5 45.5,49.5 55.5,39.5 v55.5,39 | IC3.14 64.2,27.7 62.5,26 58,26 v57,27
  Bottom 0.254: IC10.DATA 6.73,62.23 11.5,67 24,67 34,57 34,55 v32.5,53.5 | v55.5,39 55.5,28.5 v57,27
GND  (via drill 0.5, 0.6)
  Top 0.254: U1.7 21.32,67.33 v20,66
  other vias: 61.5,20 65.5,35 49.5,30 31,26.5 40.5,45 57,56.5 20,43 70.5,30 32.5,65
  pour Bottom (isolate 0.305): -1,86 82,86 82,-1 -1,-1
  pour Top (isolate 0.254): -1,86 82,86 82,-1 -1,-1
MISO  (via drill 0.6)
  Top 0.254: v71.5,27.5 v66.5,27.5 65.8,28.2 IC3.16 | v76.5,22.5 79.04,19.96 JP3.1 | v52.5,24.5 v62.5,24.5
  Bottom 0.254: v76.5,22.5 v71.5,27.5 | P1.7 24.49,39.01 40.5,23 47.5,23 48,22.5 50,22.5 52,24.5 v52.5,24.5 | v62.5,24.5 62.5,25 65,27.5 v66.5,27.5
MOSI  (via drill 0.6)
  Top 0.254: v65.5,26.5 65,27 65,27.5 | 65,27.5 IC3.15 | v49,24 50.5,25.5 63,25.5 65,27.5
  Bottom 0.254: JP3.4 75.23,12 73,12 71.5,13.5 71.5,23.5 68.5,26.5 v65.5,26.5 | P1.2 20.99,44.51 41.5,24 v49,24
N$1
  Top 0.254: IC3.20 70.55,32.6 C5.1
N$2
  Top 0.254: LED1.A 49.95,73 R1.1
N$3
  Top 0.254: LED2.A 56.9,65.05 R4.1
N$4
  Top 1.27: D1.A 14,14.75 PWR1.+4 PWR1.+3 PWR1.+2 PWR1.+1 PWR1.+ PWR1.+5 PWR1.+6 PWR1.+7 PWR1.+8
N$5
  Top 0.254: LED3.A 69.9,44.05 R6.2
N$7
  Top 0.254: IC5.10 35.8,35.75 R14.1
N$8
  Top 0.254: IC5.11 37.8,35.15 R13.1
N$9
  Top 0.254: R11.2 47.8,60.75 47.8,59.5 | 47.8,59.5 IC5.1 | 47.8,59.5 51.5,59.5 52.5,60.5 60.27,60.5 S2.2 S2.1
N$12
  Top 0.254: R12.2 43.8,61.15 IC5.3
N$27
  Top 0.254: U1.23 32.98,67.97 33.5,68.5 33.5,70.55 LED4.C
N$28
  Top 0.254: U1.22 33.27,67.33 LED5.C
N$29
  Top 0.254: IC3.7 54.54,31 Q1.1 51.59,33.95 C6.2
N$32
  Top 0.254: LED4.A R15.2
N$33
  Top 0.254: LED5.A R16.2
N$35
  Top 0.254: IC3.8 55.74,30.2 Q1.2 51.59,26.05 C11.2
N$96
  Top 0.254: C20.1 33.98,64.08 U1.17 29.43,64.08 24.23,69.28 U1.4
PCF1_D0  (via drill 0.6)
  Top 0.254: IC7.4 63.13,17.64 63.5,18 63.5,23 66.5,26 71.5,26 72.5,27 v72.5,28.5
  Bottom 0.254: v72.5,28.5 72.5,29.5 76,33 76,48.64 JP4.1
PCF1_D1  (via drill 0.6)
  Top 0.254: IC7.5 62.87,16.36 64,17.5 64,22.5 67,25.5 72,25.5 73.5,27 v73.5,27.5
  Bottom 0.254: v73.5,27.5 73.5,29.5 76.5,32.5 76.5,46.6 JP4.2
PCF1_D2  (via drill 0.6)
  Top 0.254: IC7.6 63.09,15.1 64.5,16.5 64.5,22 67.5,25 72.5,25 74.5,27 v74.5,28.5
  Bottom 0.254: v74.5,28.5 74.5,29.5 77,32 77,44.56 JP4.3
PCF1_D3
  Top 0.254: IC7.7 63.33,13.82 65,15.5 65,21.5 68,24.5 73,24.5 75.5,27 75.5,40.5 79,44 JP4.4
PCF1_D4
  Top 0.254: IC7.9 70.06,12.55 71.5,14 71.5,19 79,26.5 JP4.8
PCF1_D5
  Top 0.254: IC7.10 70.33,13.82 71,14.5 71,19.5 77,25.5 77,34.4 JP4.7
PCF1_D6
  Top 0.254: IC7.11 70.09,15.1 70.5,15.5 70.5,20 76.5,26 76.5,36.44 JP4.6
PCF1_D7
  Top 0.254: IC7.12 69.86,16.36 70,16.5 70,20.5 76,26.5 76,38.48 JP4.5
PCF2_D0
  Top 0.254: IC6.4 43.87,17.64 53,8.5 57,8.5 CON2.5
PCF2_D1
  Top 0.254: IC6.5 44.13,16.36 52.5,8 53.69,8 CON2.6
PCF2_D2
  Top 0.254: IC6.6 44.41,15.1 52.38,7.12 CON2.7
PCF2_D3
  Top 0.254: IC6.7 44.67,13.82 48.57,9.93 CON2.8
PCF2_D4
  Top 0.254: CON2.4 60.31,9 54.5,9 53.5,10 53.5,12 52.95,12.55 IC6.9
PCF2_D5
  Top 0.254: CON2.3 63.62,9.5 57.5,9.5 57,9.5 55,9.5 54,10.5 54,12.5 52.67,13.82 IC6.10
PCF2_D6
  Top 0.254: CON2.2 66.93,10 55.5,10 54.5,11 54.5,13 52.41,15.1 IC6.11
PCF2_D7
  Top 0.254: CON2.1 70.24,10.5 56,10.5 55,11.5 55,14 52.63,16.36 IC6.12
PCF3_D0
  Top 0.254: IC8.4 25.64,17.64 22.5,14.5 22.5,11.43 CON3.8
PCF3_D1
  Top 0.254: IC8.5 25.36,16.36 23,14 23,8.12 CON3.7
PCF3_D2
  Top 0.254: IC8.6 25.09,15.1 23.5,13.5 23.5,6.19 CON3.6
PCF3_D3
  Top 0.254: IC8.7 24.82,13.82 24,13 24,9.5 CON3.5
PCF3_D4
  Top 0.254: IC8.9 36.95,12.55 37.5,12 37.5,11.19 CON3.4
PCF3_D5
  Top 0.254: IC8.10 37.17,13.82 38,13 38,7.88 CON3.3
PCF3_D6
  Top 0.254: IC8.11 36.91,15.1 38.5,13.5 38.5,6.43 CON3.2
PCF3_D7
  Top 0.254: IC8.12 36.63,16.36 39,14 39,9.74 CON3.1
RESET  (via drill 0.6)
  Top 0.254: R7.1 64,40 62.6,38.6 IC3.29 62.6,35.6 v62.5,35.5 | JP3.5 75.69,15 77,15 78,16 78,18 v75,21 | D2.A 60.05,42.05 R7.1 | R7.1 65.5,43.55 65.5,44.5 66.5,45.5 73,45.5 76.5,49 76.5,51.77 S1.2 S1.1
  Bottom 0.254: v75,21 65,31 65,33 v62.5,35.5
RS485_A  (via drill 0.6)
  Top 0.254: IC2.6 v64,70.36 65.69,70.36 R9.2 | R8.2 v70,75
  Bottom 0.254: JP5.3 36,83 48.57,83 CON1.2 54.66,76.91 62.28,76.91 | v70,75 68.64,75 v64,70.36 | v70,75 74.43,79.43 CON1.8 | CON1.6 69.91,76.91 | 69.91,76.91 70,76.81 v70,75 | CON1.4 62.28,76.91 | 62.28,76.91 62.5,76.91 69.91,76.91
RS485_B
  Top 0.254: IC2.7 65.69,71.64 R9.1 R10.1 69.95,71.95 71.5,73.5 71.5,77 | 71.5,77 71.5,79.12 CON1.7 | CON1.5 66,77 | 66,77 71.5,77 | CON1.3 58.38,77 | 58.38,77 58.5,77 66,77 | CON1.1 50.76,77 58.38,77
  Bottom 0.254: JP5.4 32.73,78.73 36.5,82.5 45.26,82.5 CON1.1
RS485_DE  (via drill 0.6)
  Top 0.254: IC2.3 52.87,70.36 52,69.5 52,67.05 R3.1 v49.95,63 v50,63 | v50,50.5 50,49 56,43 v56.5,43 | v57,28.5 59,26.5 62,26.5 63.4,27.9 IC3.13
  Bottom 0.254: v49.95,63 49.95,50.55 v50,50.5 | v56.5,43 56.5,29 v57,28.5
RS485_RE  (via drill 0.6)
  Top 0.254: IC2.2 53.13,71.64 50,68.5 50,68.05 R2.1 48.45,69.5 v46,69.5 | v48.5,50.5 48.5,49.5 57,41 v57.5,41 | v58.5,28.5 58.5,28 59.5,27 60,27 61,28 IC3.10
  Bottom 0.254: v46,69.5 46,65.5 49.5,62 49.5,51.5 v48.5,50.5 | v57.5,41 57.5,29.5 v58.5,28.5
RXD  (via drill 0.6)
  Top 0.254: U1.5 21.12,68.62 v21,68.5 | v34.5,52 34.5,51.5 35.5,50.5 46.5,50.5 57,40 60.5,40 61.8,38.7 IC3.30
  Bottom 0.254: v21,68.5 24.5,68.5 35,58 35,52.5 v34.5,52
SCK  (via drill 0.6)
  Top 0.254: JP3.3 78.5,15.27 78.5,19 v76.5,21 | v70.5,28.5 68.8,30.2 IC3.17 60.2,30.2 59.5,29.5 56,29.5 55,28.5 v55,27
  Bottom 0.254: v76.5,21 70.5,27 v70.5,28.5 | P1.5 23.29,41.21 41,23.5 48,23.5 48.5,23 49.5,23 52.5,26 54,26 v55,27
SCL  (via drill 0.6)
  Top 0.254: LED3.C 67,40 66.5,39.5 64.5,39.5 63.4,38.4 IC3.28 63.4,34.4 v62,33 | IC7.14 66.41,18.91 66,18.5 66,12.5 64.5,11 56.5,11 55.5,12 55.5,14.5 54.5,15.5 v54.5,16.5 54.5,17.5 53.09,18.91 IC6.14 50.28,18.91 JP2.4 40,23.19 40,20.5 38.41,18.91 IC8.14
  Bottom 0.254: JP5.5 35.31,77.19 35.5,77 35.5,33.69 JP2.4 | v62,33 62,30.5 54.5,23 v54.5,16.5
SDA  (via drill 0.6)
  Top 0.254: R5.2 69.95,39 65,39 64.2,38.2 IC3.27 64.2,33.7 v63.5,33 | IC7.15 66.67,20.18 65.5,19 65.5,13 64,11.5 57,11.5 56,12.5 56,15 55.5,15.5 v55.5,17.5 52.83,20.18 IC6.15 49.83,20.18 45,25 45,26.73 JP2.3 41,26.73 41,25 39.5,23.5 39.5,21 38.67,20.18 IC8.15
  Bottom 0.254: JP5.6 37.81,76.81 36,75 36,34 41.27,28.73 JP2.3 | v63.5,33 63.5,31 55.5,23 v55.5,17.5
SRXD  (via drill 0.6)
  Top 0.254: v59,38.5 59.5,38.5 60.2,37.8 IC3.32
  Bottom 0.254: JP1.2 64.19,39.69 63.5,39 59.5,39 v59,38.5
SRXD_ESP  (via drill 0.6)
  Top 0.254: v48,44.5 47.8,44.3 IC5.16
  Bottom 0.254: JP1.1 60.15,51.5 54.5,51.5 48,45 v48,44.5
SRXD_MAX  (via drill 0.6)
  Top 0.254: LED1.C 51.5,71 53.41,72.91 IC2.1 56.09,72.91 v57,72 | JP1.3 66.73,50.73 68,52 71.5,52 72.5,53 72.5,63 68.5,67 59.5,67 v59,66.5
  Bottom 0.254: v59,66.5 57,68.5 v57,72
STXD  (via drill 0.6)
  Top 0.254: v61,35.5 60.7,35.8 IC3.1
  Bottom 0.254: JP1.5 71.81,46.31 v61,35.5
STXD_ESP  (via drill 0.6)
  Top 0.254: v46,44 45.8,43.8 IC5.15
  Bottom 0.254: JP1.4 67.27,52 54,52 v46,44
STXD_MAX
  Top 0.254: LED2.C 52.5,64.45 52.5,68.5 53.09,69.09 IC2.4 56.52,67.5 69,67.5 73,63.5 73,53 74.35,51.65 JP1.6
TXD  (via drill 0.6)
  Top 0.254: U1.1 21.73,71.22 v20,69.5 | v34,53.5 33.5,53 33.5,51.5 35,50 46,50 56.5,39.5 60,39.5 61,38.5 IC3.31
  Bottom 0.254: v20,69.5 20,68 20.5,67.5 24.5,67.5 34.5,57.5 34.5,54 v34,53.5
USBDM
  Top 0.254: X1.2 15,67.5 20.5,62 27,62 28.43,63.42 U1.16
USBDP
  Top 0.254: X1.3 13,74.5 14.5,73 14.5,67 20,61.5 27.5,61.5 28.77,62.77 U1.15
VCC
  Top 0.254: 7,28 7.95,28 C3.2
  Top 1.27: D1.C arc90 12,22 7,22 arc-90 4,25 arc-90 7,28 11.95,28 arc-90 C4.2 16.35,27.95 arc90 C1.+ C2.+ C7.+ 22.35,33.05 C8.1 15.47,33.05 IC1.1 12.28,35.72 11,37 11,42.92 IC4.1 14.13,46.05 C14.1

### Text on the board
tPlace: artetechnic.com